# EAGLE schematic Tritag_Color_Sensor_Board (EAGLE 8.6.0)
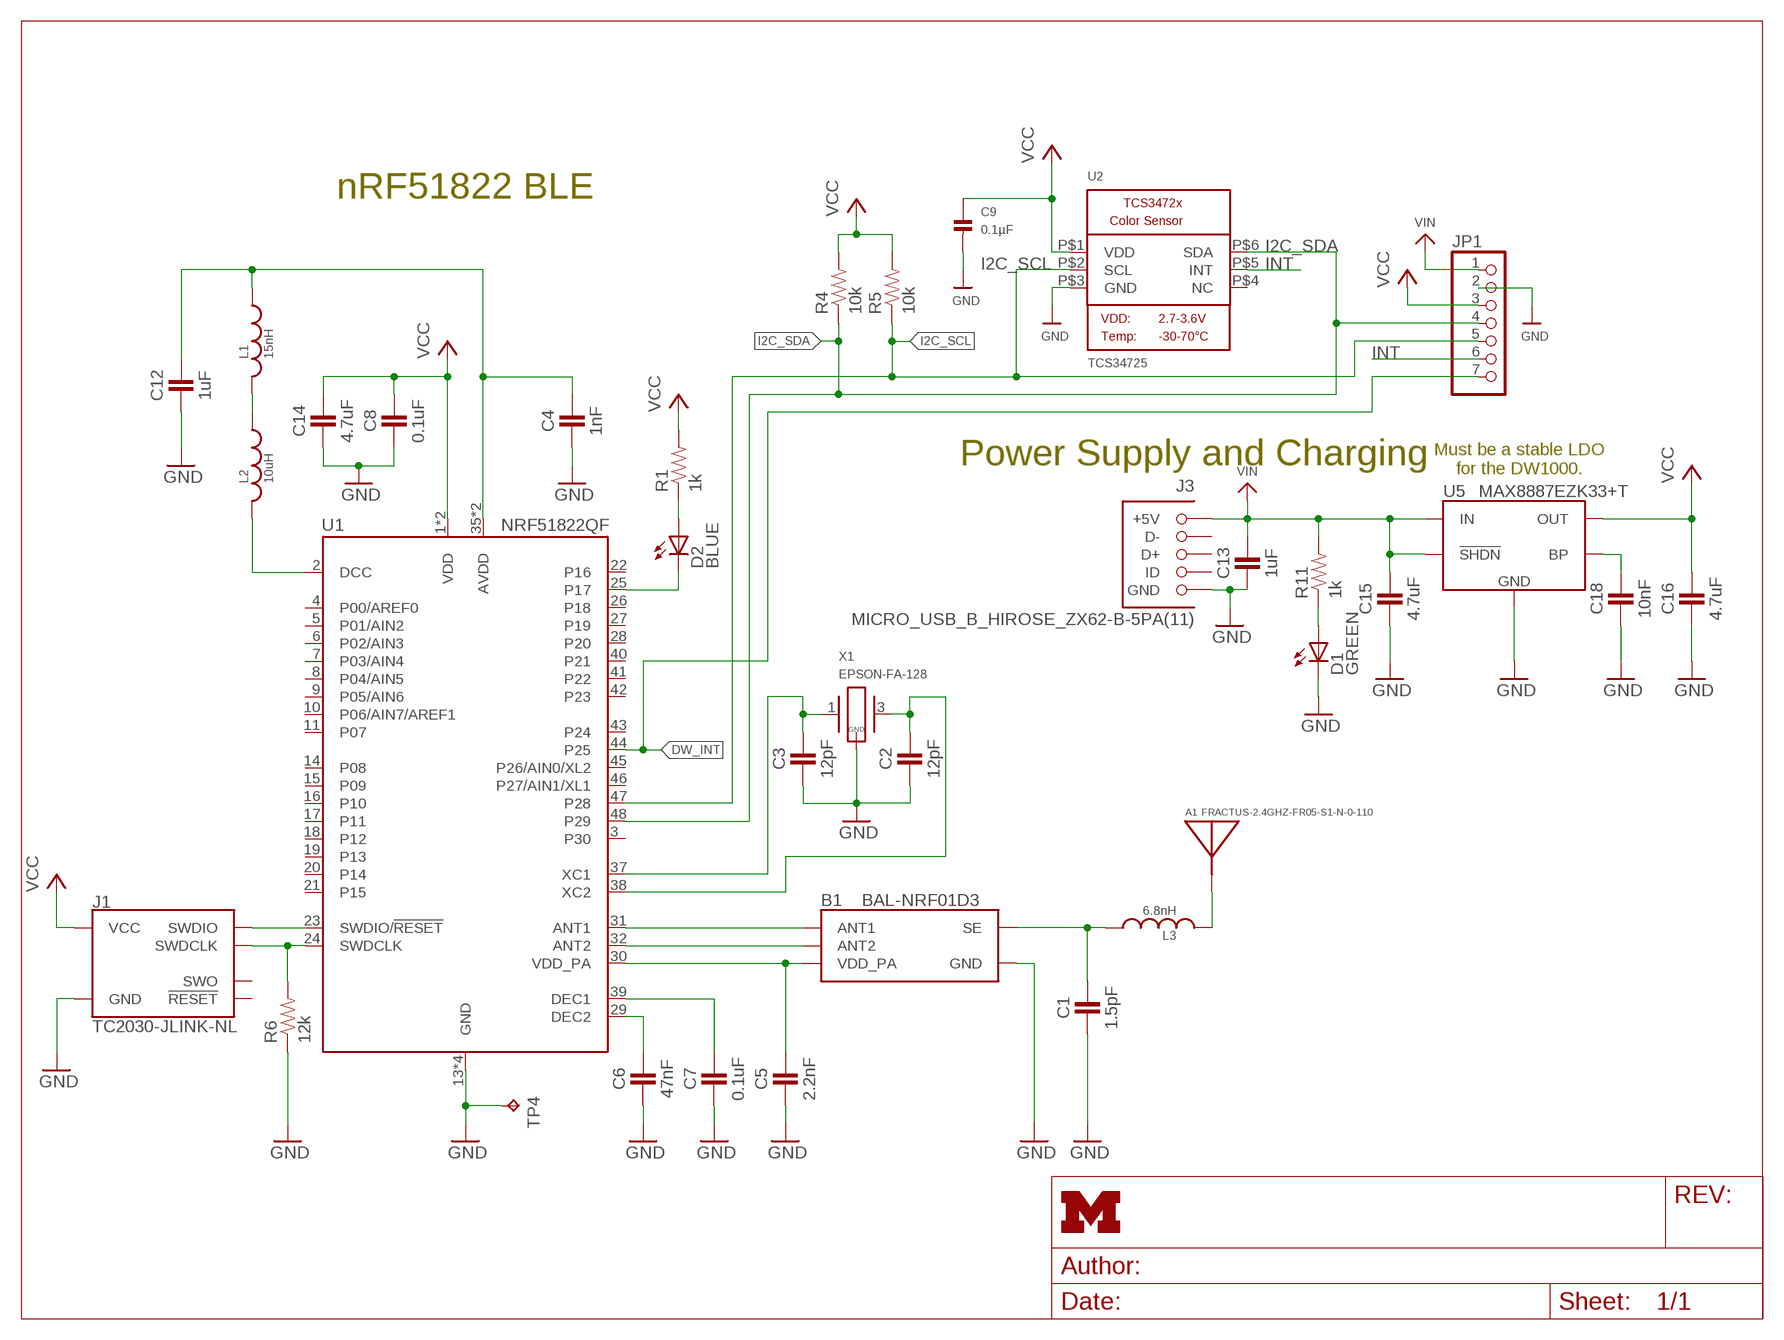
[diagram p0: schematic, sheet 1]
FRAME2 (LETTER_L): HEIGHT: 8.5in; WIDTH: 11in

## Parts
A1  FRACTUS-2.4GHZ-FR05-S1-N-0-110  [FRACTUS-ANTENNA-FR05-S1-N-0-110]
B1  BAL-NRF01D3  [BAL-NRF01D3]
C1  1.5pF  CAPACITOR  [0402_CAP]
C2  12pF  CAPACITOR  [0402_CAP]
C3  12pF  CAPACITOR  [0402_CAP]
C4  1nF  CAPACITOR  [0402_CAP]
C5  2.2nF  CAPACITOR  [0402_CAP]
C6  47nF  CAPACITOR  [0402_CAP]
C7  0.1uF  CAPACITOR  [0402_CAP]
C8  0.1uF  CAPACITOR  [0402_CAP]
C9  0.1µF  CAP_CERAMIC_0805  [_0805]
C12  1uF  CAPACITOR  [0402_CAP]
C13  1uF  CAPACITOR  [0402_CAP]
C14  4.7uF  CAPACITOR  [0402_CAP]
C15  4.7uF  CAPACITOR  [0402_CAP]
C16  4.7uF  CAPACITOR  [0402_CAP]
C18  10nF  CAPACITOR  [0402_CAP]
D1  GREEN  LED0603  [LED-0603]
D2  BLUE  LED0603  [LED-0603]
J1  TC2030-JLINK-NL  [TC2030-IDC-NL]
J3  MICRO_USB_B_HIROSE_ZX62-B-5PA(11)  [USB_MICRO_B-HIROSE-ZX62-B-5PA(11)]
JP1  HEADER-1X770MIL  [1X07_ROUND_70]
L1  15nH  INDUCTOR0402  [0402_CAP]
L2  10uH  INDUCTOR0603  [0603_CAP]
L3  6.8nH  INDUCTOR0402  [0402_CAP]
R1  1k  RESISTOR0402_RES  [0402_RES]
R4  10k  RESISTOR0402_RES  [0402_RES]
R5  10k  RESISTOR0402_RES  [0402_RES]
R6  12k  RESISTOR0402_RES  [0402_RES]
R11  1k  RESISTOR0402_RES  [0402_RES]
TP4  TPTP06SQ  [TP06SQ]
U1  NRF51822QF  [QFN-48-6MM]
U2  TCS34725  LIGHT_TCS3472  [TCS3472_FN6]
U5  MAX8887EZK33+T  [SOT-23-5]
X1  EPSON-FA-128  [FA-128]

## Nets
!CHRG: D1.A R11.1
!CHRG1: D2.A R1.1
ANTENNA: A1.ANT(ANTENNA) L3.2
AVDD: C4.1 C12.1 L1.1 U1.35(AVDD) U1.36(AVDD)
DCC: L2.2 U1.2(DCC)
DW_INT: JP1.7 U1.44(P25)
GND: B1.GND C1.2 C2.2 C3.2 C4.2 C5.2 C6.2 C7.2 C8.2 C9.2 C12.2 C13.2 C14.2 C15.2 C16.2 C18.2 D1.C J1.5(GND) J3.5(GND) JP1.2 R6.1 TP4.TP U1.13(GND) U1.33(GND) U1.34(GND) U1.GND U2.P$3(GND) U5.2(GND) X1.2(GND) X1.4(GND)
I2C_SCL: JP1.5 R5.1 U1.47(P28) U2.P$2(SCL)
I2C_SDA: JP1.4 R4.1 U1.48(P29) U2.P$6(SDA)
INT: JP1.6 U2.P$5(INT)
N$2: B1.SE C1.1 L3.1
N$6: D2.C U1.25(P17)
N$9: C3.1 U1.37(XC1) X1.1
N$10: C2.1 U1.38(XC2) X1.3
N$11: C18.1 U5.4(BP)
N$15: C6.1 U1.29(DEC2)
N$17: C7.1 U1.39(DEC1)
N$18: B1.ANT1 U1.31(ANT1)
N$19: B1.ANT2 U1.32(ANT2)
N$20: B1.VCC(VDD_PA) C5.1 U1.30(VDD_PA)
N$37: L1.2 L2.1
SWDCLK: J1.4(SWDCLK) R6.2 U1.24(SWDCLK)
SWDIO/!RESET: J1.2(SWDIO) U1.23(SWDIO/!RESET)
VCC: C8.1 C9.1 C14.1 C16.1 J1.1(VCC) JP1.3 R1.2 R4.2 R5.2 U1.1(VDD) U1.12(VDD) U2.P$1(VDD) U5.5(OUT)
VIN: C13.1 C15.1 J3.1(+5V) JP1.1 R11.2 U5.1(IN) U5.3(!SHDN)
Unconnected: J1.3(!RESET) J1.6(SWO) J3.2(D-) J3.3(D+) J3.4(ID) U1.3(P30) U1.4(P00/AREF0) U1.5(P01/AIN2) U1.6(P02/AIN3) U1.7(P03/AIN4) U1.8(P04/AIN5) U1.9(P05/AIN6) U1.10(P06/AIN7/AREF1) U1.11(P07) U1.14(P08) U1.15(P09) U1.16(P10) U1.17(P11) U1.18(P12) U1.19(P13) U1.20(P14) U1.21(P15) U1.22(P16) U1.26(P18) U1.27(P19) U1.28(P20) U1.40(P21) U1.41(P22) U1.42(P23) U1.43(P24) U1.45(P26/AIN0/XL2) U1.46(P27/AIN1/XL1) U2.P$4(NC)

## Notes on the sheet
- nRF51822 BLE
- Power Supply and Charging
- Must be a stable LDO
  for the DW1000.

## Library data of the parts
A1 = chips:FRACTUS-2.4GHZ-FR05-S1-N-0-110: Fractus Micro Reach Xtend Requires matching network.; RICHARDSON_RFPD: FR05-S1-N-0110B
B1 = chips:BAL-NRF01D3: 50 ohm nominal input / conjugate match balun to nRF51422-QFAA, nRF24LE1, nRF51822-QFAA/AB, with integrated harmonic filter; DIGIKEY: 497-13637-1-ND; MOUSER: 511-BAL-NRF01D3
C1-C8 C12-C16 C18 = passives:CAPACITOR: 0402 Capacitor
C9 = microbuilder:CAP_CERAMIC: Ceramic Capacitors 0402 - 0402 Surface Mount Capacitors 16pF 50V 5% [Digikey: 445-4899-2-ND] 18pF 50V 5% [Digikey: 490-1281-2-ND] 22pF 50V 5% [Digikey: 490-1283-2-ND] 68pF 50V 5% [Digikey: 490-1289-2-ND] 0.1uF 10V 10% [Digikey: 490-1318-2-ND] 1.0uF 6.3V 10% [Digikey: 490-1320-2-ND] 0603 - 0603 Surface Mount Capacitors 16 pF 50V 5% [Digikey: 445-5051-2-ND] 22 pF 50V [Digikey: PCC220ACVTR-ND] 33 pF 50V 5% [Digikey: 490-1415-1-ND] 56pF 50V 5% [Digikey: 490-1421-1-ND] 220pF 50V 5% [Digikey: 445-1285-1-ND] 680 pF 50V 2200 pF 50V 5% C0G [Digikey: 445-1297-1-ND] 5600 pF 100V 5% X7R [Digikey: 478-3711-1-ND] 0.1 µF 25V 10% [Digikey: PCC2277TR-ND] 0.22 µF 16V 10% X7R [Digikey: 445-1318-1-ND] 1.0 µF 25V 10% [Digikey: 445-5146-2-ND] 0603 - RF Specific 3pF 250V +/-0.1pF RF [Digikey: 712-1347-1-ND] 18 pF 250V 5% [Digikey: 478-3505-1-ND or 712-1322-1-ND] 56 pF 250V 5% C0G RF [Digikey: 490-4867-1-ND] 68 pF 250V RF [Digikey: 490-4868-1-ND] 0805 - 0805 Surface Mount Capacitors 220 pF 250V 2% RF Ceramic Capacitor [Digikey: 712-1398-1-ND] 1000 pF 50V 2% NP0 Ceramic Capacitor [Digikey: 478-3760-1-ND] 0.1 µF 25V 10% Ceramic Capacitor [Digikey: PCC1828TR-ND] 1.0 µF 16V 10% Ceramic Capacitor[Digikey: 490-1691-2-ND] 10.0 µF 10V 10% Ceramic Capacitor[Digikey: 709-1228-1-ND] 10.0 uF 16V 10% Ceramic Capacitor [Digikey: 478-5165-2-ND] 47 uF 6.3V 20% Ceramic Capacitor [Digikey: 587-1779-1-ND or 399-5506-1-ND] 1206 - 1206 Surface Mount Capacitors 47uF 10V 20% Ceramic Capacitor [Digikey: 490-5528-1-ND or 399-5508-1-ND or 445-6010-1-ND] 100uF 6.3V -20%, +80% Y5V Ceramic Capacitor (Digikey: 490-4512-1-ND, Mouser: 81-GRM31CF50J107ZE1L)
D1 D2 = SparkFun-LED:LED: LEDs Standard schematic elements and footprints for 5mm, 3mm, 1206, and 0603 sized LEDs. 5mm - Spark Fun Electronics SKU : COM-00529 (and others)
J1 = connector:TC2030-JLINK
J3 = connector:MICRO_USB_B_HIROSE_ZX62-B-5PA(11): Connector Receptacle USB - micro B 2.0 5 Position Surface Mount, Right Angle, Horizontal Bottom Mount; DIGIKEY: H11634CT-ND; MOUSER: 798-ZX62-B-5PA11; NEWARK: 86P8793
JP1 = microbuilder:HEADER-1X7: PIN HEADER
L1-L3 = passives:INDUCTOR
R1 R4-R6 R11 = passives:RESISTOR: Resistor Basic schematic elements and footprints for 0603, 1206, and PTH resistors.
TP4 = testpad:TP: Test pad
U1 = chips:NRF51822: Multiprotocol Bluetooth® 4.0 low energy/2.4 GHz RF SoC; DIGIKEY: 1490-1032-1-ND; MOUSER: 949-NRF51822-QFAB-R7
U2 = microbuilder:LIGHT_TCS3472: TCS3472 RGB + Clear Color Sensor VDD: 2.7-3.6V Temp: -30 - 70°C IR light blocking filter 3,800,000:1 Dynamic Range 2.5µA sleep state Part IDs TCS34725: I2C bus logic = VDD, I2C address: 0x29 TCS34727: I2C bus logic = 1.8V, I2C address: 0x29
U5 = chips:MAX8887: IC REG LDO 3.3V 0.3A TSOT23-5; DIGIKEY: MAX8887EZK33+TCT-ND
X1 = crystals:EPSON-FA-128: MHz RANGE CRYSTAL UNIT ULTRA MINIATURE SIZE LOW PROFILE SMD http://www.digikey.com/product-search/en?FV=ffec63d1